# Altium schematic sheet Mạch Phát.SchDoc
size A4; SheetNumber: 1; SheetTotal: 2
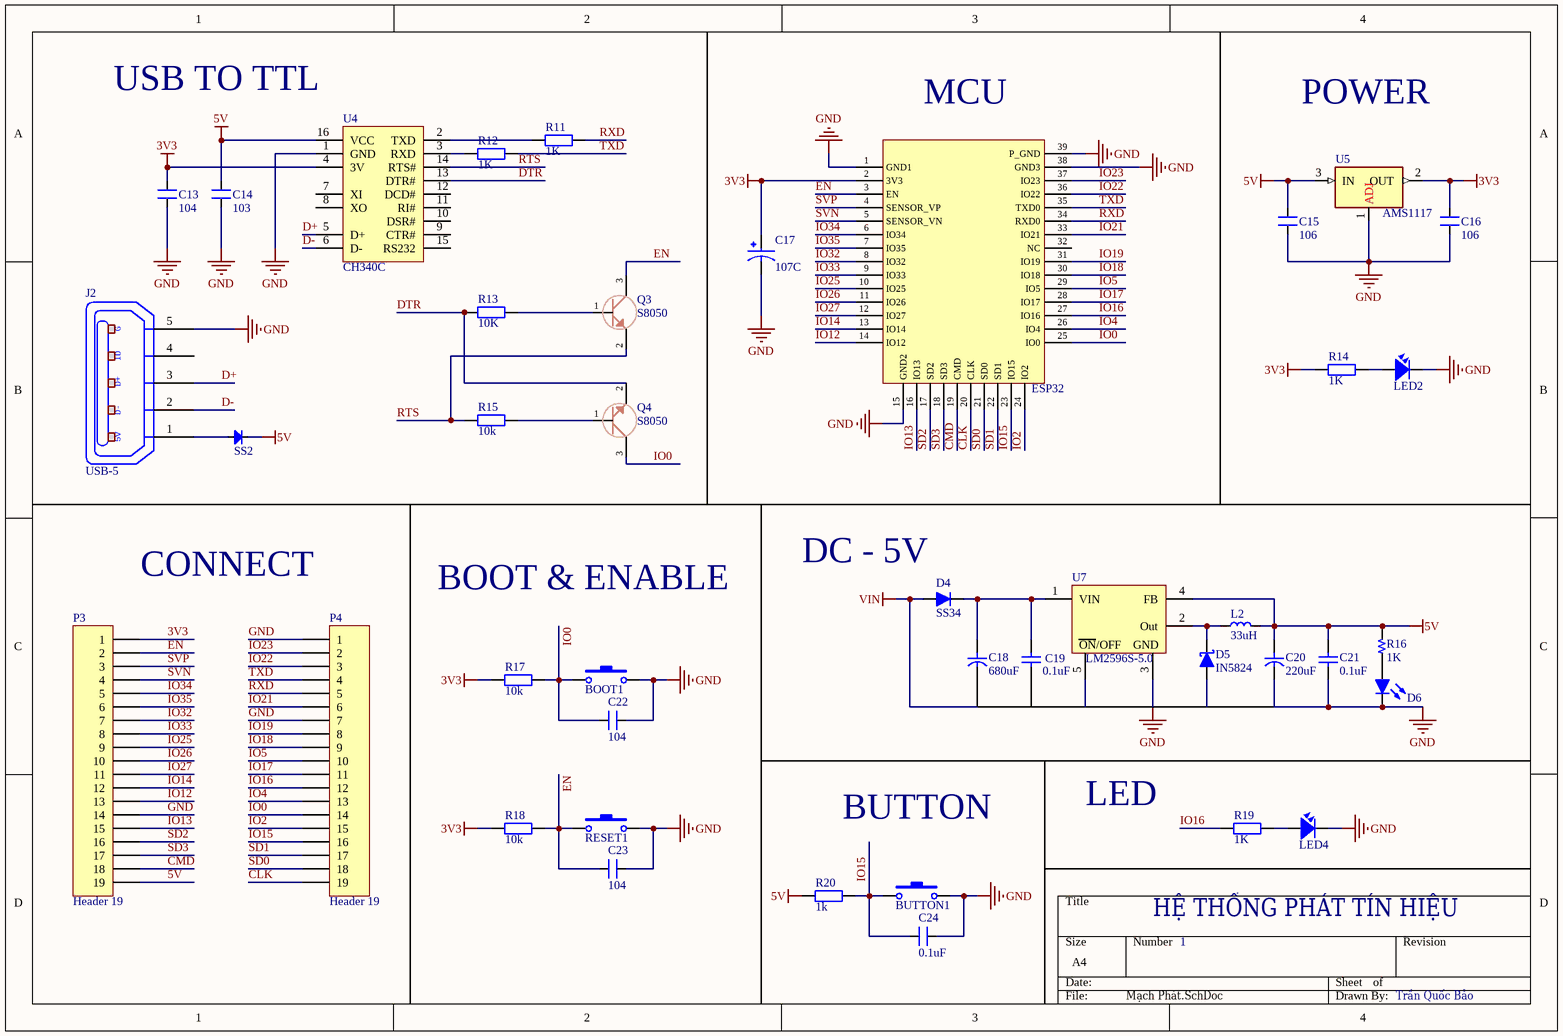
[diagram p0: Mạch Phát.SchDoc]

## Parts
BOOT1  SW-SMD  [SW-SMD]  (value not drawn)
BUTTON1  SW-SMD  [SW-SMD]  (value not drawn)
C13  104  [SM-0805]
C14  103  [SM-0805]
C15  106  [SM-0805]
C16  106  [SM-0805]
C17  107C  [CAP_TANTALUM_3528]
C18  680uF  [C SMD TAN 1206 (A)]
C19  0.1uF  [C 0805]
C20  220uF  [C SMD TAN 1206 (A)]
C21  0.1uF  [C 0805]
C22  104  [SM-0805]
C23  104  [SM-0805]
C24  0.1uF  [SM-0805]
D4  SS34  [DO-35 (SOD27 )]
D5  IN5824  [DO-41]
D6  Led  [Led 0805 RED]  (value not drawn)
ESP32  ESP32  [ESP_WROOM_32]  (value not drawn)
J2  USB-5  [USB-M1]
L2  33uH  [Inductor SMD 12x12x8]
LED2  LED  [LED 3512]  (value not drawn)
LED4  LED  [LED 3512]  (value not drawn)
P3  Header 19  [HDR1X19]
P4  Header 19  [HDR1X19]
Q3  S8050  [SOT23]
Q4  S8050  [SOT23]
R11  value 1K  [DIEN TRO 0805]  (hidden comment: R0805)
R12  value 1K  [DIEN TRO 0805]  (hidden comment: R0805)
R13  value 10K  [DIEN TRO 0805]  (hidden comment: R0805)
R14  value 1K  [DIEN TRO 0805]  (hidden comment: R0805)
R15  value 10k  [DIEN TRO 0805]  (hidden comment: R0805)
R16  1K  [R 0805]
R17  value 10k  [DIEN TRO 0805]  (hidden comment: R0805)
R18  value 10k  [DIEN TRO 0805]  (hidden comment: R0805)
R19  value 1K  [DIEN TRO 0805]  (hidden comment: R0805)
R20  value 1k  [DIEN TRO 0805]  (hidden comment: R0805)
RESET1  SW-SMD  [SW-SMD]  (value not drawn)
SS2  Diode SMD  [DIO-SMD-106]  (value not drawn)
U4  CH340C  [SO16]
U5  AMS1117  [SOT223-4N]
U7  LM2596S-5.0  [TO-263-5]

## Nets
3V3: C13.2 C16.2 C17.1 ESP32.2(3V3) P3.1 R14.1 R17.1 R18.1 U4.4(3V) U5.2(OUT)
5V: C14.2 C15.2 C20.1 C21.1 L2.2 P3.19 R16.2 R20.1 SS2.2(K) U4.16(VCC) U5.3(IN) U7.4(FB)
GND: BOOT1.2 BUTTON1.2 C13.1 C14.1 C15.1 C16.1 C17.2 C20.2 C21.2 C22.1 C23.1 C24.1 D6.2(K) ESP32.1(GND1) ESP32.15(GND2) ESP32.38(GND3) ESP32.39(P_GND) J2.5(P5) LED2.2 LED4.2 P3.14 P4.1 P4.7 RESET1.2 U4.1(GND) U5.1(ADJ) U7.3(GND)
VIN: D4.1(A)
CLK: ESP32.20(CLK) P4.19
CMD: ESP32.19(CMD) P3.18
D+: J2.3(P3) U4.5(D+)
D-: J2.2(P2) U4.6(D-)
DTR: Q4.2(E) R13.1 U4.13(DTR#)
EN: C23.2 ESP32.3(EN) P3.2 Q3.3(C) R18.2 RESET1.1
IO0: BOOT1.1 C22.2 ESP32.25(IO0) P4.14 Q4.3(C) R17.2
IO2: ESP32.24(IO2) P4.15
IO4: ESP32.26(IO4) P4.13
IO5: ESP32.29(IO5) P4.10
IO12: ESP32.14(IO12) P3.13
IO13: ESP32.16(IO13) P3.15
IO14: ESP32.13(IO14) P3.12
IO15: BUTTON1.1 C24.2 ESP32.23(IO15) P4.16 R20.2
IO16: ESP32.27(IO16) P4.12 R19.1
IO17: ESP32.28(IO17) P4.11
IO18: ESP32.30(IO18) P4.9
IO19: ESP32.31(IO19) P4.8
IO21: ESP32.33(IO21) P4.6
IO22: ESP32.36(IO22) P4.3
IO23: ESP32.37(IO23) P4.2
IO25: ESP32.10(IO25) P3.9
IO26: ESP32.11(IO26) P3.10
IO27: ESP32.12(IO27) P3.11
IO32: ESP32.8(IO32) P3.7
IO33: ESP32.9(IO33) P3.8
IO34: ESP32.6(IO34) P3.5
IO35: ESP32.7(IO35) P3.6
RTS: Q3.2(E) R15.1 U4.14(RTS#)
RXD: ESP32.34(RXD0) P4.5 R11.2
SD0: ESP32.21(SD0) P4.18
SD1: ESP32.22(SD1) P4.17
SD2: ESP32.17(SD2) P3.16
SD3: ESP32.18(SD3) P3.17
SVN: ESP32.5(SENSOR_VN) P3.4
SVP: ESP32.4(SENSOR_VP) P3.3
TXD: ESP32.35(TXD0) P4.4 R12.2
NetC18_1: C18.1 C19.1 D4.2(K) U7.1(VIN)
NetD5_2: D5.2(K) L2.1 U7.2(Out)
NetD6_1: D6.1(A) R16.1
NetJ2_1: J2.1(P1) SS2.1(A)
NetLED2_1: LED2.1 R14.2
NetLED4_1: LED4.1 R19.2
NetQ3_1: Q3.1(B) R13.2
NetQ4_1: Q4.1(B) R15.2
NetR11_1: R11.1 U4.2(TXD)
NetR12_1: R12.1 U4.3(RXD)

Not connected (* = marked no-connect by the designer): C18 2; C19 2; D5 1(A); ESP32 32(NC); J2 4(P4); U4 7(XI) 8(XO) 9(CTR#) 10(DSR#) 11(RI#) 12(DCD#) 15(RS232); U7 5(~{ON}/OFF) 6(PAD)

## Notes on the sheet
- USB TO TTL
- (near ESP32) MCU
- POWER
- CONNECT
- (near D4) DC - 5V
- BOOT & ENABLE
- BUTTON
- LED
- HỆ THỐNG PHÁT TÍN HIỆU
- 1
- Trần Quốc Bảo
- (in symbol LM2596S-5.0) ON/OFF
- (in symbol USB-5) G; ID; D+; D-; 5V

## Library data of the parts
BOOT1 BUTTON1 RESET1 = SW-SMD: Switch; Published: 24-Mar-1999; LatestRevisionDate: 17-Jul-2002; LatestRevisionNote: Re-released for DXP Platform.; PackageReference: SPST-2; Publisher: Altium Limited
C13 C15 C16 C22-C24 = CM: Cap SMD; Value: 103
C14 = CM: Cap SMD; Value: 103
C17 = CAP_TANTALUM_SMD: Capacitor, Tantalum; MF: AVX; MP: TAJB475K025RNJ; SnapEDA_Link: https://www.snapeda.com/parts/TAJB475K025RNJ/AVX/view-part/?ref=snap; Package: 1411 AVX Corporation; Value: *; Check_prices: https://www.snapeda.com/parts/TAJB475K025RNJ/AVX/view-part/?ref=eda
C18 C20 = Capacitor: Capacitor pol
C19 C21 = Capacitor NP: Capacitor non-pol
D4 = Diode: Default Diode
D5 = Diode Schottky: Schottky Diode
D6 = Led: Typical LED
ESP32 = ESP-WROOM-32
J2 = USB-5: Manufacturer: FCI; Manufacturer Part Number: 10118193-0001LF; Connector Type: USB - micro B; Number of Contacts: 5; Gender: Receptacle; Specifications: USB 2.0; .Creator: MM; .Checked PCB: RF; Supplier 1: Digi-Key; RoHS: RoHS Compliant; Category: Connectors, Interconnects; Stock 1: 28642; Pricing 1: 1=0.46, 10=0.433, 25=0.3712, 50=0.3156, 100=0.3032, 250=0.27224, 500=0.25988 (USD); Packaging: Cut Tape (CT); Mounting Type: Surface Mount, Right Angle, Horizontal; Features: Shielded, Solder Retention; Ingress Protection: -; ComponentLink1URL: http://portal.fciconnect.com/Comergent//fci/drawing/10118193.pdf; ComponentLink1Description: http://portal.fciconnect.com/Comergent//fci/drawing/10118193.pdf; Supplier Part Number 1: 609-4616-1-ND; .Checked SCH: MM
L2 = Inductor
LED2 LED4 = LED SMD: Value: LED 3 - 5 ly 2 Colour
P3 P4 = Header 19: Header, 19-Pin; LatestRevisionDate: 17-Jul-2002; LatestRevisionNote: Re-released for DXP Platform.; Publisher: Altium Limited
Q3 Q4 = Transitor SMD
R11-R15 R17-R20 = R0805: Resistor SMD 0805; Published: 8-Jun-2000; LatestRevisionDate: 17-Jul-2002; LatestRevisionNote: Re-released for DXP Platform.; PackageReference: AXIAL-0.4; Publisher: Altium Limited
R16 = Resistor
SS2 = Diode SMD: Default Diode; Code - JEDEC: DO-214-AB; Value: 1N5007; Published: 8-Jun-2000; Revision: July-2002: Re-released for DXP Platform.; Publisher: Altium Limited
U4 = CH340G: High and Low Side Driver; Note: Pins 4, 8 and 14 are not connected; Published: 8-Jun-2000; LatestRevisionDate: 04-Mar-2005; LatestRevisionNote: Stylized 3D Model Added.; DatasheetVersion: PD60147J; PackageReference: PDIP14; Publisher: Altium Limited; PackageDescription: DIP; 14 Leads; Row Spacing 7.62 mm; Pitch 2.54 mm; ComponentLink1Description: Manufacturer Link; ComponentLink1URL: http://www.irf.com/; ComponentLink2Description: Datasheet; ComponentLink2URL: http://www.irf.com/product-info/datasheets/data/ir2110.pdf
U5 = AMS1117: IC
U7 = LM2596S-5.0: Simple Switcher 3A Step-Down Voltage Regulator